# Altium project 左手键盘1.PrjPcb
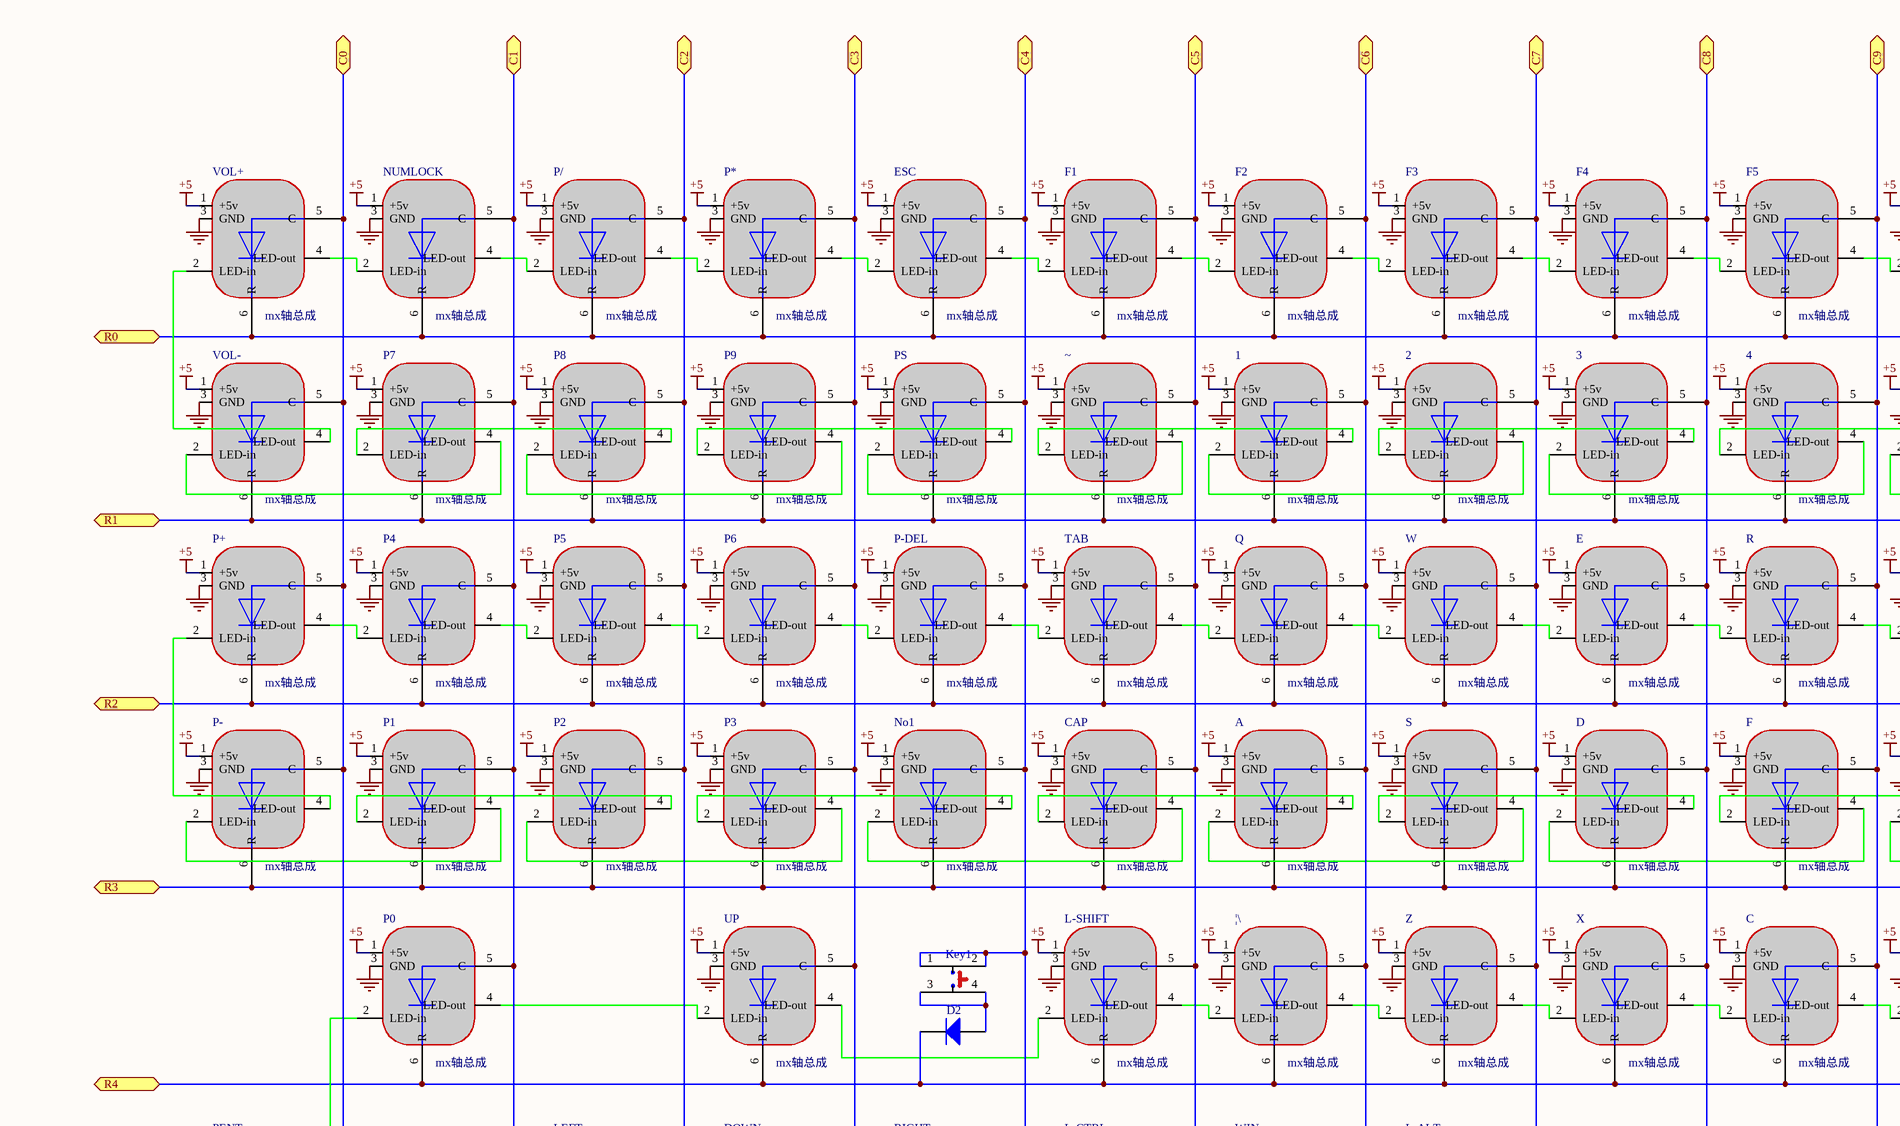
[diagram p0: 左手键盘1.SchDoc, top left]
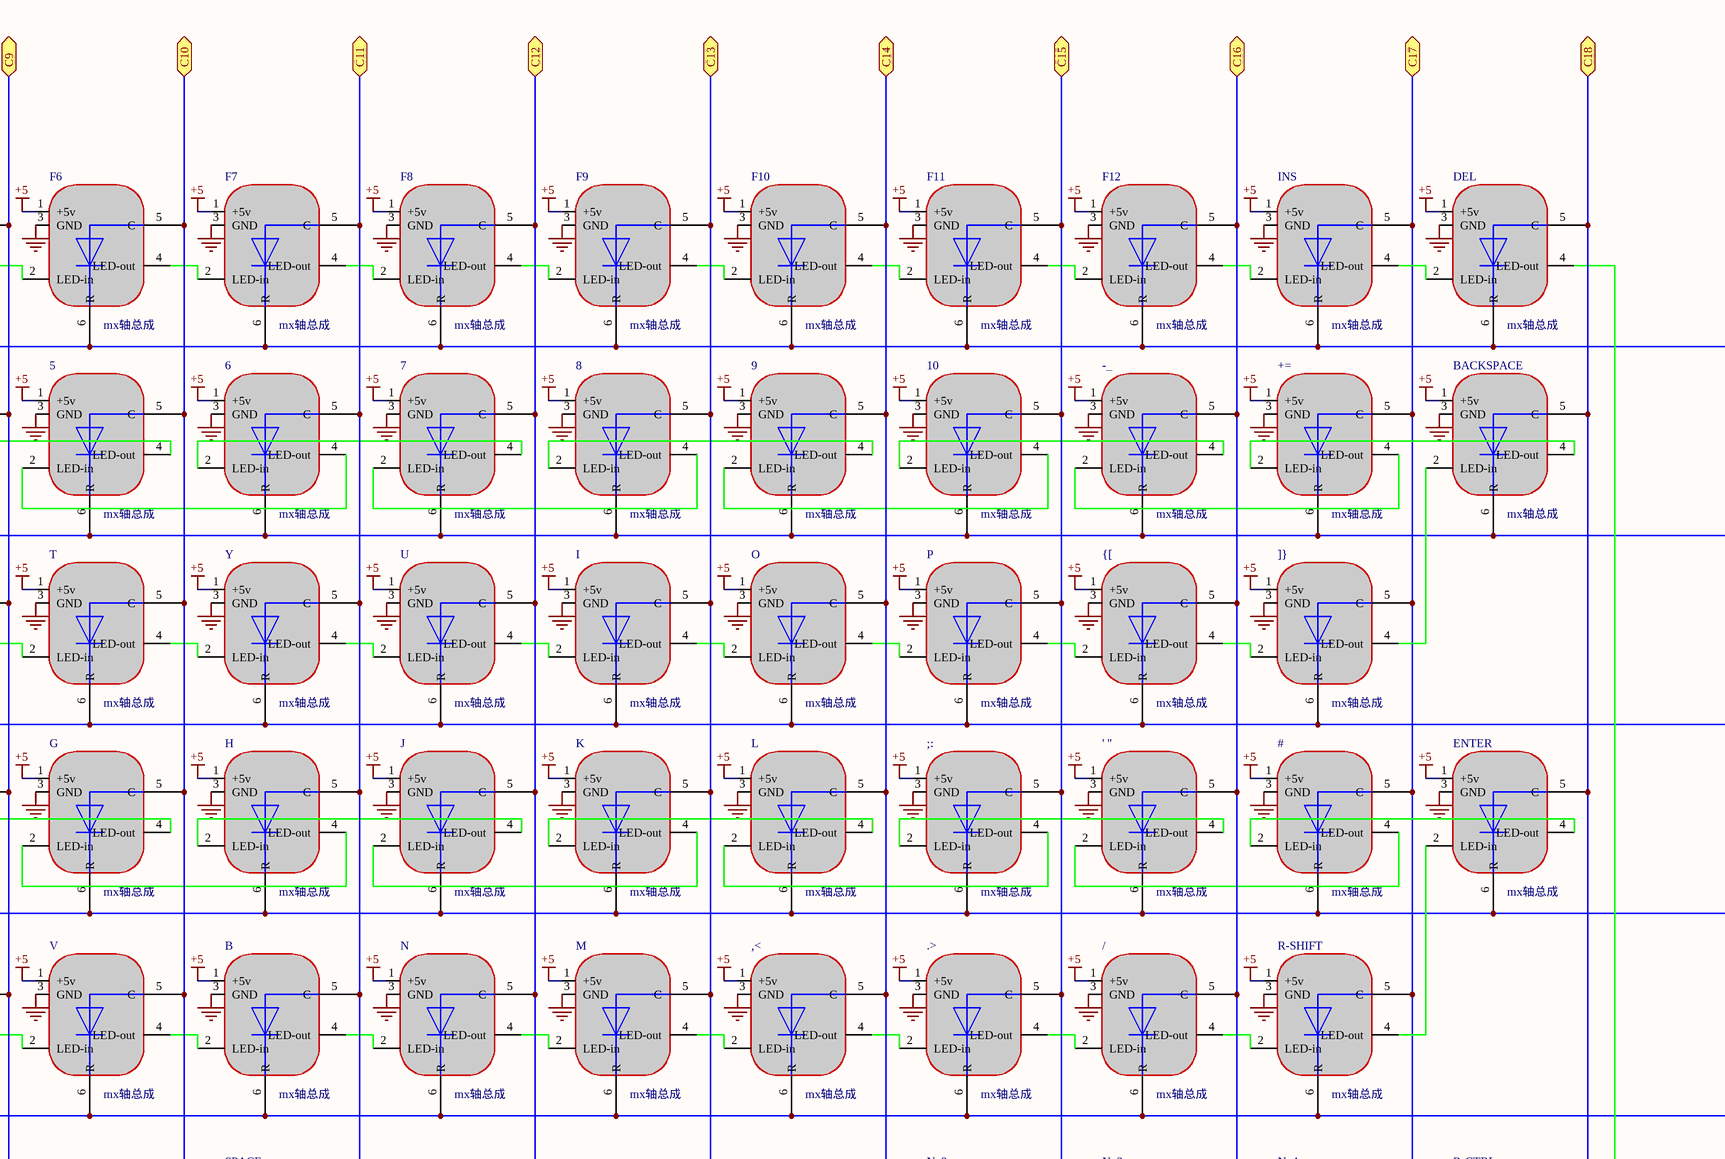
[diagram p1: 左手键盘1.SchDoc, top right]
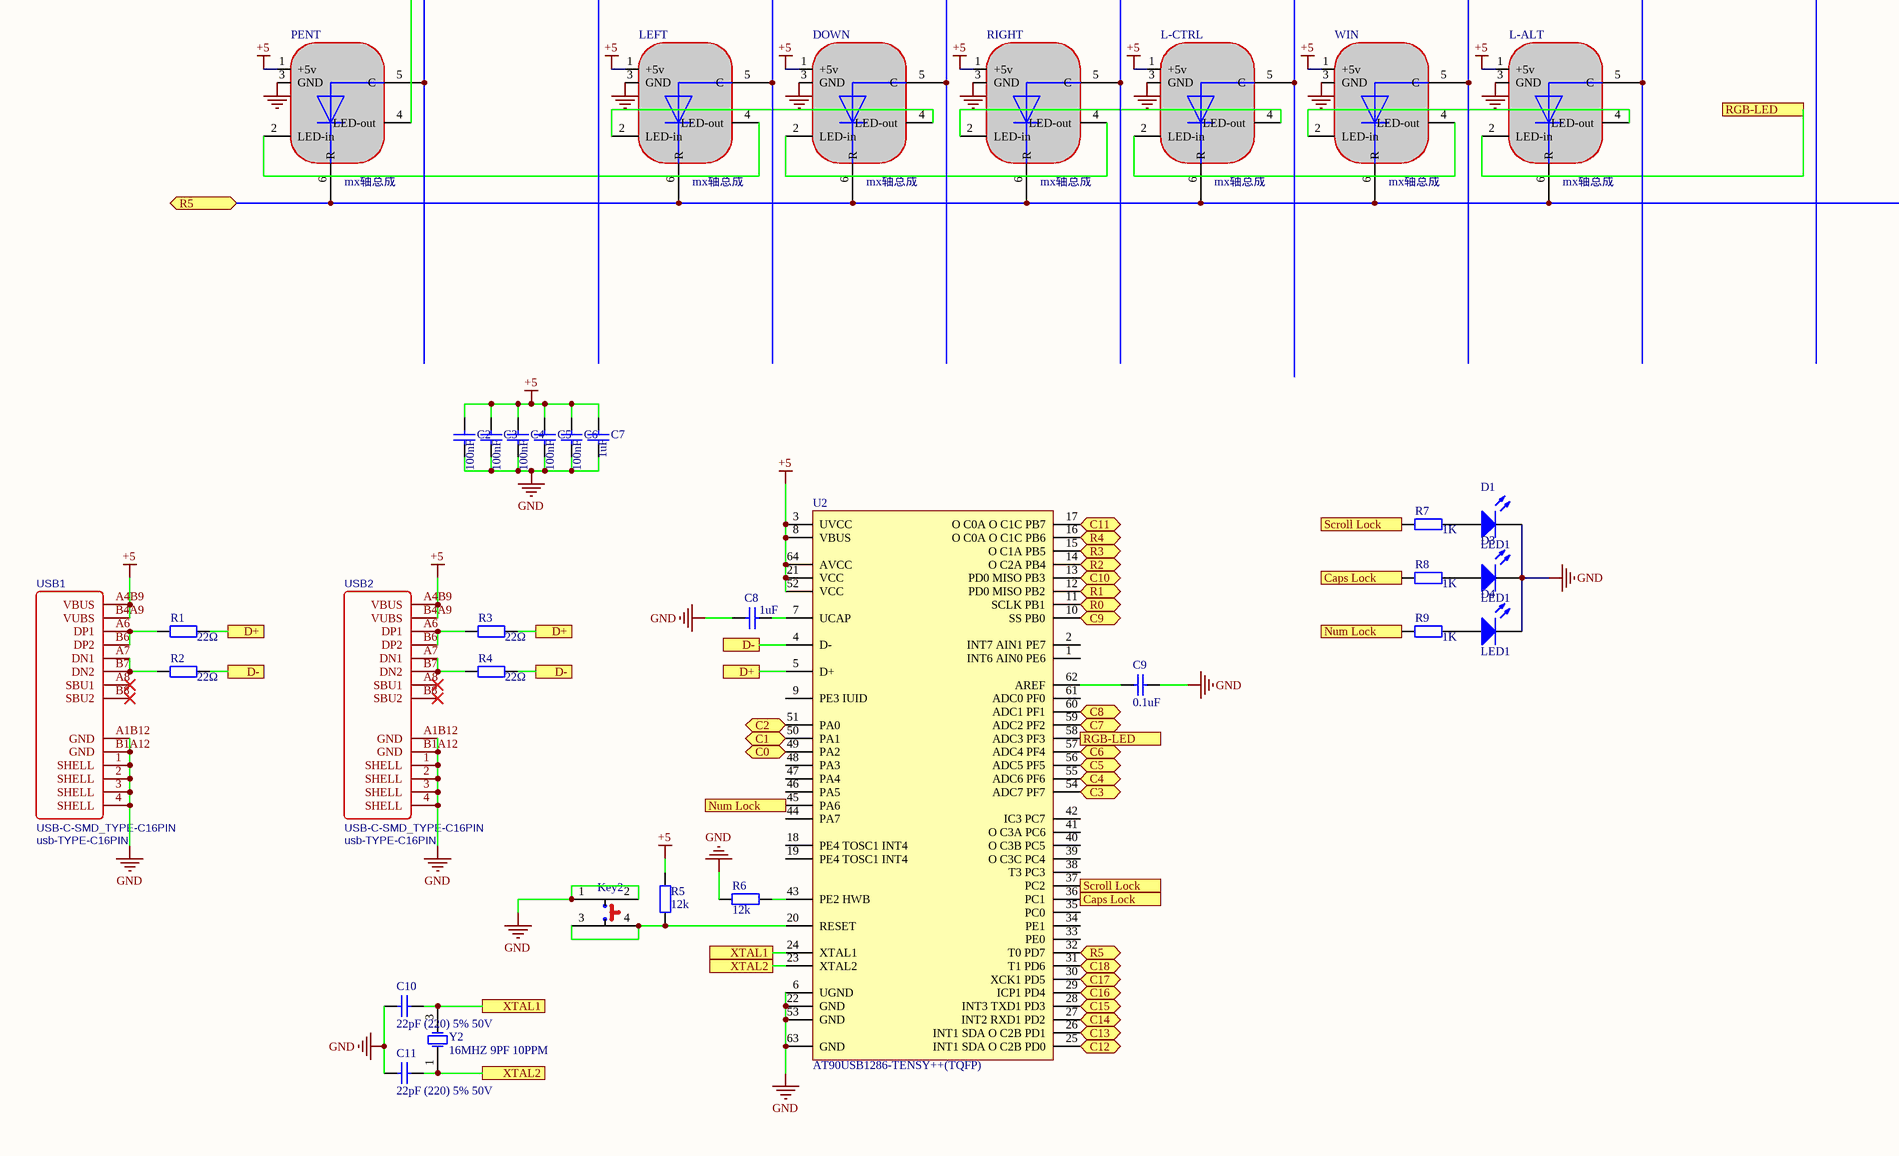
[diagram p2: 左手键盘1.SchDoc, bottom left]
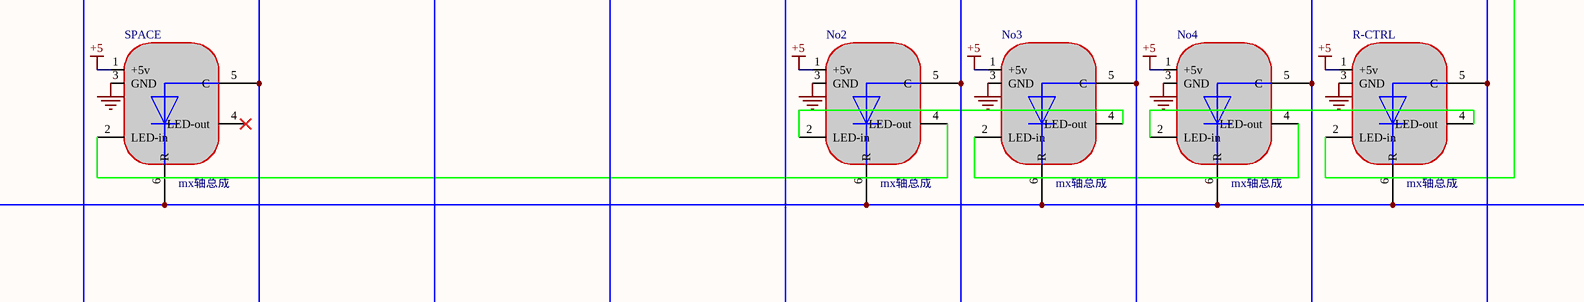
[diagram p3: 左手键盘1.SchDoc, bottom right]
1 sheet, 131 parts. Net scope: flat (ports and power ports of the same name join across sheets).
Board file: 左手键盘1.PcbDoc

## Sheet 左手键盘1.SchDoc
size A1

### Parts
1  mx轴总成  [mx-zc-fan]
2  mx轴总成  [mx-zc-fan]
3  mx轴总成  [mx-zc-fan]
4  mx轴总成  [mx-zc-fan]
5  mx轴总成  [mx-zc-fan]
6  mx轴总成  [mx-zc-fan]
7  mx轴总成  [mx-zc-fan]
8  mx轴总成  [mx-zc-fan]
9  mx轴总成  [mx-zc-fan]
10  mx轴总成  [mx-zc-fan]
#  mx轴总成  [mx-zc-fan]
'_"  mx轴总成  [mx-zc-fan]
+=  mx轴总成  [mx-zc-fan]
,<  mx轴总成  [mx-zc-zheng]
-_  mx轴总成  [mx-zc-fan]
.>  mx轴总成  [mx-zc-zheng]
/  mx轴总成  [mx-zc-zheng]
;:  mx轴总成  [mx-zc-fan]
]}  mx轴总成  [mx-zc-zheng]
A  mx轴总成  [mx-zc-fan]
B  mx轴总成  [mx-zc-zheng]
BACKSPACE  mx轴总成  [mx-zc-fan]
C  mx轴总成  [mx-zc-zheng]
C2  100nF  [C0805]
C3  100nF  [C0805]
C4  100nF  [C0805]
C5  100nF  [C0805]
C6  100nF  [C0805]
C7  1uF  [C0805]
C8  1uF  [C0805]
C9  0.1uF  [C0805]
C10  22pF (220) 5% 50V  [C0805]
C11  22pF (220) 5% 50V  [C0805]
CAP  mx轴总成  [mx-zc-fan]
D  mx轴总成  [mx-zc-fan]
D1  LED1  [LED0805背开孔]
D2  LL4148 LL-34 1206  [4148]  (value not drawn)
D3  LED1  [LED0805背开孔]
D4  LED1  [LED0805背开孔]
DEL  mx轴总成  [mx-zc-zheng]
DOWN  mx轴总成  [mx-zc-fan]
E  mx轴总成  [mx-zc-zheng]
ENTER  mx轴总成  [mx-zc-fan]
ESC  mx轴总成  [mx-zc-zheng]
F  mx轴总成  [mx-zc-fan]
F1  mx轴总成  [mx-zc-zheng]
F2  mx轴总成  [mx-zc-zheng]
F3  mx轴总成  [mx-zc-zheng]
F4  mx轴总成  [mx-zc-zheng]
F5  mx轴总成  [mx-zc-zheng]
F6  mx轴总成  [mx-zc-zheng]
F7  mx轴总成  [mx-zc-zheng]
F8  mx轴总成  [mx-zc-zheng]
F9  mx轴总成  [mx-zc-zheng]
F10  mx轴总成  [mx-zc-zheng]
F11  mx轴总成  [mx-zc-zheng]
F12  mx轴总成  [mx-zc-zheng]
G  mx轴总成  [mx-zc-fan]
H  mx轴总成  [mx-zc-fan]
I  mx轴总成  [mx-zc-zheng]
INS  mx轴总成  [mx-zc-zheng]
J  mx轴总成  [mx-zc-fan]
K  mx轴总成  [mx-zc-fan]
Key1  KEY-SMD_4P-L4.2-W3.2-P2.20-LS4.6  [key-4p-5*5mm]  (value not drawn)
Key2  KEY-SMD_4P-L4.2-W3.2-P2.20-LS4.6  [key-4p-5*5mm]  (value not drawn)
L  mx轴总成  [mx-zc-fan]
L-ALT  mx轴总成  [mx-zc-fan]
L-CTRL  mx轴总成  [mx-zc-fan]
L-SHIFT  mx轴总成  [MX-ZC-ZHENG]
LEFT  mx轴总成  [MX-ZC-FAN]
M  mx轴总成  [mx-zc-zheng]
N  mx轴总成  [mx-zc-zheng]
No1  mx轴总成  [mx-zc-fan]
No2  mx轴总成  [mx-zc-fan]
No3  mx轴总成  [mx-zc-fan]
No4  mx轴总成  [mx-zc-fan]
NUMLOCK  mx轴总成  [mx-zc-zheng]
O  mx轴总成  [mx-zc-zheng]
P  mx轴总成  [mx-zc-zheng]
P0  mx轴总成  [mx-zc-zheng]
P1  mx轴总成  [mx-zc-fan]
P2  mx轴总成  [mx-zc-fan]
P3  mx轴总成  [mx-zc-fan]
P4  mx轴总成  [mx-zc-zheng]
P5  mx轴总成  [mx-zc-zheng]
P6  mx轴总成  [mx-zc-zheng]
P7  mx轴总成  [mx-zc-fan]
P8  mx轴总成  [mx-zc-fan]
P9  mx轴总成  [mx-zc-fan]
P*  mx轴总成  [mx-zc-zheng]
P+  mx轴总成  [mx-zc-zheng]
P-  mx轴总成  [mx-zc-fan]
P-DEL  mx轴总成  [mx-zc-zheng]
P/  mx轴总成  [mx-zc-zheng]
PENT  mx轴总成  [mx-zc-fan]
PS  mx轴总成  [mx-zc-fan]
Q  mx轴总成  [mx-zc-zheng]
R  mx轴总成  [mx-zc-zheng]
R1  22Ω  [R0805]
R2  22Ω  [R0805]
R3  22Ω  [R0805]
R4  22Ω  [R0805]
R5  12k  [R0805]
R6  12k  [R0805]
R7  1K  [R0805]
R8  1K  [R0805]
R9  1K  [R0805]
R-CTRL  mx轴总成  [mx-zc-fan]
R-SHIFT  mx轴总成  [mx-zc-zheng]
RIGHT  mx轴总成  [mx-zc-fan]
S  mx轴总成  [mx-zc-fan]
SPACE  mx轴总成  [mx-zc-fan]
T  mx轴总成  [mx-zc-zheng]
TAB  mx轴总成  [mx-zc-zheng]
U  mx轴总成  [mx-zc-zheng]
U2  AT90USB1286-TENSY++(TQFP)  [QFN64 9x9_M]
UP  mx轴总成  [mx-zc-zheng]
USB1  usb-TYPE-C16PIN  [USB-C-SMD_TYPE-C16PIN]
USB2  usb-TYPE-C16PIN  [USB-C-SMD_TYPE-C16PIN]
V  mx轴总成  [mx-zc-zheng]
VOL+  mx轴总成  [mx-zc-zheng]
VOL-  mx轴总成  [mx-zc-fan]
W  mx轴总成  [mx-zc-zheng]
WIN  mx轴总成  [mx-zc-fan]
X  mx轴总成  [mx-zc-zheng]
Y  mx轴总成  [mx-zc-zheng]
Y2  16MHZ 9PF 10PPM  [SMD-3225_4P]
Z  mx轴总成  [mx-zc-zheng]
{[  mx轴总成  [mx-zc-zheng]
~  mx轴总成  [mx-zc-fan]
|\  mx轴总成  [mx-zc-zheng]

### Ports
C0 (bidir), C1 (bidir), C2 (bidir), C3 (bidir), C4 (bidir), C5 (bidir), C6 (bidir), C7 (bidir), C8 (bidir), C9 (bidir), C10 (bidir), C11 (bidir), C12 (bidir), C13 (bidir), C14 (bidir), C15 (bidir), C16 (bidir), C17 (bidir), C18 (bidir), Caps Lock, D+, D-, Num Lock, R0 (bidir), R1 (bidir), R2 (bidir), R3 (bidir), R4 (bidir), R5 (bidir), RGB-LED, RGB-LED (out), Scroll Lock, XTAL1, XTAL2

### Nets
+5: 1.1(+5v) 2.1(+5v) 3.1(+5v) 4.1(+5v) 5.1(+5v) 6.1(+5v) 7.1(+5v) 8.1(+5v) 9.1(+5v) 10.1(+5v) #.1(+5v) '_".1(+5v) +=.1(+5v) ,<.1(+5v) -_.1(+5v) .>.1(+5v) /.1(+5v) ;:.1(+5v) ]}.1(+5v) A.1(+5v) B.1(+5v) BACKSPACE.1(+5v) C.1(+5v) C2.2 C3.2 C4.2 C5.2 C6.2 C7.2 CAP.1(+5v) D.1(+5v) DEL.1(+5v) DOWN.1(+5v) E.1(+5v) ENTER.1(+5v) ESC.1(+5v) F.1(+5v) F1.1(+5v) F2.1(+5v) F3.1(+5v) F4.1(+5v) F5.1(+5v) F6.1(+5v) F7.1(+5v) F8.1(+5v) F9.1(+5v) F10.1(+5v) F11.1(+5v) F12.1(+5v) G.1(+5v) H.1(+5v) I.1(+5v) INS.1(+5v) J.1(+5v) K.1(+5v) L.1(+5v) L-ALT.1(+5v) L-CTRL.1(+5v) L-SHIFT.1(+5v) LEFT.1(+5v) M.1(+5v) N.1(+5v) No1.1(+5v) No2.1(+5v) No3.1(+5v) No4.1(+5v) NUMLOCK.1(+5v) O.1(+5v) P.1(+5v) P0.1(+5v) P1.1(+5v) P2.1(+5v) P3.1(+5v) P4.1(+5v) P5.1(+5v) P6.1(+5v) P7.1(+5v) P8.1(+5v) P9.1(+5v) P*.1(+5v) P+.1(+5v) P-.1(+5v) P-DEL.1(+5v) P/.1(+5v) PENT.1(+5v) PS.1(+5v) Q.1(+5v) R.1(+5v) R5.2 R-CTRL.1(+5v) R-SHIFT.1(+5v) RIGHT.1(+5v) S.1(+5v) SPACE.1(+5v) T.1(+5v) TAB.1(+5v) U.1(+5v) U2.3(UVCC) U2.8(VBUS) U2.21(VCC) U2.52(VCC) U2.64(AVCC) UP.1(+5v) USB1.A4B9(VBUS) USB1.B4A9(VUBS) USB2.A4B9(VBUS) USB2.B4A9(VUBS) V.1(+5v) VOL+.1(+5v) VOL-.1(+5v) W.1(+5v) WIN.1(+5v) X.1(+5v) Y.1(+5v) Z.1(+5v) {[.1(+5v) ~.1(+5v) |\.1(+5v)
GND: 1.3(GND) 2.3(GND) 3.3(GND) 4.3(GND) 5.3(GND) 6.3(GND) 7.3(GND) 8.3(GND) 9.3(GND) 10.3(GND) #.3(GND) '_".3(GND) +=.3(GND) ,<.3(GND) -_.3(GND) .>.3(GND) /.3(GND) ;:.3(GND) ]}.3(GND) A.3(GND) B.3(GND) BACKSPACE.3(GND) C.3(GND) C2.1 C3.1 C4.1 C5.1 C6.1 C7.1 C8.1 C9.2 C10.1 C11.1 CAP.3(GND) D.3(GND) D1.2(K) D3.2(K) D4.2(K) DEL.3(GND) DOWN.3(GND) E.3(GND) ENTER.3(GND) ESC.3(GND) F.3(GND) F1.3(GND) F2.3(GND) F3.3(GND) F4.3(GND) F5.3(GND) F6.3(GND) F7.3(GND) F8.3(GND) F9.3(GND) F10.3(GND) F11.3(GND) F12.3(GND) G.3(GND) H.3(GND) I.3(GND) INS.3(GND) J.3(GND) K.3(GND) Key2.1 Key2.2 L.3(GND) L-ALT.3(GND) L-CTRL.3(GND) L-SHIFT.3(GND) LEFT.3(GND) M.3(GND) N.3(GND) No1.3(GND) No2.3(GND) No3.3(GND) No4.3(GND) NUMLOCK.3(GND) O.3(GND) P.3(GND) P0.3(GND) P1.3(GND) P2.3(GND) P3.3(GND) P4.3(GND) P5.3(GND) P6.3(GND) P7.3(GND) P8.3(GND) P9.3(GND) P*.3(GND) P+.3(GND) P-.3(GND) P-DEL.3(GND) P/.3(GND) PENT.3(GND) PS.3(GND) Q.3(GND) R.3(GND) R6.2 R-CTRL.3(GND) R-SHIFT.3(GND) RIGHT.3(GND) S.3(GND) SPACE.3(GND) T.3(GND) TAB.3(GND) U.3(GND) U2.6(UGND) U2.22(GND) U2.53(GND) U2.63(GND) UP.3(GND) USB1.1(SHELL) USB1.2(SHELL) USB1.3(SHELL) USB1.4(SHELL) USB1.A1B12(GND) USB1.B1A12(GND) USB2.1(SHELL) USB2.2(SHELL) USB2.3(SHELL) USB2.4(SHELL) USB2.A1B12(GND) USB2.B1A12(GND) V.3(GND) VOL+.3(GND) VOL-.3(GND) W.3(GND) WIN.3(GND) X.3(GND) Y.3(GND) Z.3(GND) {[.3(GND) ~.3(GND) |\.3(GND)
Net1_2: 1.2(LED-in) 2.4(LED-out)
Net1_4: 1.4(LED-out) ~.2(LED-in)
Net1_5: 1.5(C) A.5(C) F2.5(C) Q.5(C) U2.57(ADC4_PF4) WIN.5(C) |\.5(C) ; port C6
Net1_6: 1.6(R) 2.6(R) 3.6(R) 4.6(R) 5.6(R) 6.6(R) 7.6(R) 8.6(R) 9.6(R) 10.6(R) +=.6(R) -_.6(R) BACKSPACE.6(R) P7.6(R) P8.6(R) P9.6(R) PS.6(R) U2.12(PD0_MISO_PB2) VOL-.6(R) ~.6(R) ; port R1
Net2_2: 2.2(LED-in) 3.4(LED-out)
Net2_5: 2.5(C) F3.5(C) L-ALT.5(C) S.5(C) U2.59(ADC2_PF2) W.5(C) Z.5(C) ; port C7
Net3_2: 3.2(LED-in) 4.4(LED-out)
Net3_5: 3.5(C) D.5(C) E.5(C) F4.5(C) U2.60(ADC1_PF1) X.5(C) ; port C8
Net4_2: 4.2(LED-in) 5.4(LED-out)
Net4_5: 4.5(C) C.5(C) F.5(C) F5.5(C) R.5(C) U2.10(SS_PB0) ; port C9
Net5_2: 5.2(LED-in) 6.4(LED-out)
Net5_5: 5.5(C) F6.5(C) G.5(C) T.5(C) U2.13(PD0_MISO_PB3) V.5(C) ; port C10
Net6_2: 6.2(LED-in) 7.4(LED-out)
Net6_5: 6.5(C) B.5(C) F7.5(C) H.5(C) SPACE.5(C) U2.17(O_C0A_O_C1C_PB7) Y.5(C) ; port C11
Net7_2: 7.2(LED-in) 8.4(LED-out)
Net7_5: 7.5(C) F8.5(C) J.5(C) N.5(C) U.5(C) U2.25(INT1_SDA_O_C2B_PD0) ; port C12
Net8_2: 8.2(LED-in) 9.4(LED-out)
Net8_5: 8.5(C) F9.5(C) I.5(C) K.5(C) M.5(C) U2.26(INT1_SDA_O_C2B_PD1) ; port C13
Net9_2: 9.2(LED-in) 10.4(LED-out)
Net9_5: 9.5(C) ,<.5(C) F10.5(C) L.5(C) O.5(C) U2.27(INT2_RXD1_PD2) ; port C14
Net10_2: 10.2(LED-in) -_.4(LED-out)
Net10_5: 10.5(C) .>.5(C) ;:.5(C) F11.5(C) No2.5(C) P.5(C) U2.28(INT3_TXD1_PD3) ; port C15
Net#_2: #.2(LED-in) ENTER.4(LED-out)
Net#_4: #.4(LED-out) '_".2(LED-in)
Net#_5: #.5(C) +=.5(C) ]}.5(C) INS.5(C) No4.5(C) R-SHIFT.5(C) U2.30(XCK1_PD5) ; port C17
Net#_6: #.6(R) '_".6(R) ;:.6(R) A.6(R) CAP.6(R) D.6(R) ENTER.6(R) F.6(R) G.6(R) H.6(R) J.6(R) K.6(R) L.6(R) No1.6(R) P1.6(R) P2.6(R) P3.6(R) P-.6(R) S.6(R) U2.15(O_C1A_PB5) ; port R3
Net'_"_4: '_".4(LED-out) ;:.2(LED-in)
Net'_"_5: '_".5(C) -_.5(C) /.5(C) F12.5(C) No3.5(C) U2.29(ICP1_PD4) {[.5(C) ; port C16
Net+=_2: +=.2(LED-in) BACKSPACE.4(LED-out)
Net+=_4: +=.4(LED-out) -_.2(LED-in)
Net,<_2: ,<.2(LED-in) M.4(LED-out)
Net,<_4: ,<.4(LED-out) .>.2(LED-in)
Net,<_6: ,<.6(R) .>.6(R) /.6(R) B.6(R) C.6(R) D2.2(K) L-SHIFT.6(R) M.6(R) N.6(R) P0.6(R) R-SHIFT.6(R) U2.16(O_C0A_O_C1C_PB6) UP.6(R) V.6(R) X.6(R) Z.6(R) |\.6(R) ; port R4
Net.>_4: .>.4(LED-out) /.2(LED-in)
Net/_4: /.4(LED-out) R-SHIFT.2(LED-in)
Net;:_4: ;:.4(LED-out) L.2(LED-in)
Net]}_2: ]}.2(LED-in) {[.4(LED-out)
Net]}_4: ]}.4(LED-out) BACKSPACE.2(LED-in)
Net]}_6: ]}.6(R) E.6(R) I.6(R) O.6(R) P.6(R) P4.6(R) P5.6(R) P6.6(R) P+.6(R) P-DEL.6(R) Q.6(R) R.6(R) T.6(R) TAB.6(R) U.6(R) U2.14(O_C2A_PB4) W.6(R) Y.6(R) {[.6(R) ; port R2
NetA_2: A.2(LED-in) S.4(LED-out)
NetA_4: A.4(LED-out) CAP.2(LED-in)
NetB_2: B.2(LED-in) V.4(LED-out)
NetB_4: B.4(LED-out) N.2(LED-in)
NetBACKSPACE_5: BACKSPACE.5(C) DEL.5(C) ENTER.5(C) R-CTRL.5(C) U2.31(T1_PD6) ; port C18
NetC8_2: C8.2 U2.7(UCAP)
NetC9_1: C9.1 U2.62(AREF)
NetC10_2: C10.2 U2.24(XTAL1) Y2.3(OSC2) ; port XTAL1
NetC11_2: C11.2 U2.23(XTAL2) Y2.1(OSC1) ; port XTAL2
NetC_2: C.2(LED-in) X.4(LED-out)
NetC_4: C.4(LED-out) V.2(LED-in)
NetCAP_4: CAP.4(LED-out) No1.2(LED-in)
NetCAP_5: CAP.5(C) F1.5(C) L-CTRL.5(C) L-SHIFT.5(C) TAB.5(C) U2.56(ADC5_PF5) ~.5(C) ; port C5
NetD1_1: D1.1(A) R7.2
NetD2_1: D2.1(A) Key1.3 Key1.4
NetD3_1: D3.1(A) R8.2
NetD4_1: D4.1(A) R9.2
NetD_2: D.2(LED-in) F.4(LED-out)
NetD_4: D.4(LED-out) S.2(LED-in)
NetDEL_2: DEL.2(LED-in) INS.4(LED-out)
NetDEL_4: DEL.4(LED-out) R-CTRL.2(LED-in)
NetDEL_6: DEL.6(R) ESC.6(R) F1.6(R) F2.6(R) F3.6(R) F4.6(R) F5.6(R) F6.6(R) F7.6(R) F8.6(R) F9.6(R) F10.6(R) F11.6(R) F12.6(R) INS.6(R) NUMLOCK.6(R) P*.6(R) P/.6(R) U2.11(SCLK_PB1) VOL+.6(R) ; port R0
NetDOWN_2: DOWN.2(LED-in) RIGHT.4(LED-out)
NetDOWN_4: DOWN.4(LED-out) LEFT.2(LED-in)
NetDOWN_5: DOWN.5(C) P3.5(C) P6.5(C) P9.5(C) P*.5(C) U2.54(ADC7_PF7) UP.5(C) ; port C3
NetDOWN_6: DOWN.6(R) L-ALT.6(R) L-CTRL.6(R) LEFT.6(R) No2.6(R) No3.6(R) No4.6(R) PENT.6(R) R-CTRL.6(R) RIGHT.6(R) SPACE.6(R) U2.32(T0_PD7) WIN.6(R) ; port R5
NetE_2: E.2(LED-in) W.4(LED-out)
NetE_4: E.4(LED-out) R.2(LED-in)
NetENTER_2: ENTER.2(LED-in) R-SHIFT.4(LED-out)
NetESC_2: ESC.2(LED-in) P*.4(LED-out)
NetESC_4: ESC.4(LED-out) F1.2(LED-in)
NetESC_5: ESC.5(C) Key1.1 Key1.2 No1.5(C) P-DEL.5(C) PS.5(C) RIGHT.5(C) U2.55(ADC6_PF6) ; port C4
NetF1_4: F1.4(LED-out) F2.2(LED-in)
NetF2_4: F2.4(LED-out) F3.2(LED-in)
NetF3_4: F3.4(LED-out) F4.2(LED-in)
NetF4_4: F4.4(LED-out) F5.2(LED-in)
NetF5_4: F5.4(LED-out) F6.2(LED-in)
NetF6_4: F6.4(LED-out) F7.2(LED-in)
NetF7_4: F7.4(LED-out) F8.2(LED-in)
NetF8_4: F8.4(LED-out) F9.2(LED-in)
NetF9_4: F9.4(LED-out) F10.2(LED-in)
NetF10_4: F10.4(LED-out) F11.2(LED-in)
NetF11_4: F11.4(LED-out) F12.2(LED-in)
NetF12_4: F12.4(LED-out) INS.2(LED-in)
NetF_2: F.2(LED-in) G.4(LED-out)
NetG_2: G.2(LED-in) H.4(LED-out)
NetH_2: H.2(LED-in) J.4(LED-out)
NetI_2: I.2(LED-in) U.4(LED-out)
NetI_4: I.4(LED-out) O.2(LED-in)
NetJ_2: J.2(LED-in) K.4(LED-out)
NetK_2: K.2(LED-in) L.4(LED-out)
NetKey2_3: Key2.3 Key2.4 R5.1 U2.20(RESET)
NetL-ALT_2: L-ALT.2(LED-in) U2.58(ADC3_PF3) ; port RGB-LED
NetL-ALT_4: L-ALT.4(LED-out) WIN.2(LED-in)
NetL-CTRL_2: L-CTRL.2(LED-in) WIN.4(LED-out)
NetL-CTRL_4: L-CTRL.4(LED-out) RIGHT.2(LED-in)
NetL-SHIFT_2: L-SHIFT.2(LED-in) UP.4(LED-out)
NetL-SHIFT_4: L-SHIFT.4(LED-out) |\.2(LED-in)
NetLEFT_4: LEFT.4(LED-out) PENT.2(LED-in)
NetLEFT_5: LEFT.5(C) P2.5(C) P5.5(C) P8.5(C) P/.5(C) U2.51(PA0) ; port C2
NetM_2: M.2(LED-in) N.4(LED-out)
NetNo1_4: No1.4(LED-out) P3.2(LED-in)
NetNo2_2: No2.2(LED-in) No3.4(LED-out)
NetNo2_4: No2.4(LED-out) SPACE.2(LED-in)
NetNo3_2: No3.2(LED-in) No4.4(LED-out)
NetNo4_2: No4.2(LED-in) R-CTRL.4(LED-out)
NetNUMLOCK_2: NUMLOCK.2(LED-in) VOL+.4(LED-out)
NetNUMLOCK_4: NUMLOCK.4(LED-out) P/.2(LED-in)
NetNUMLOCK_5: NUMLOCK.5(C) P0.5(C) P1.5(C) P4.5(C) P7.5(C) U2.50(PA1) ; port C1
NetO_4: O.4(LED-out) P.2(LED-in)
NetP0_2: P0.2(LED-in) PENT.4(LED-out)
NetP0_4: P0.4(LED-out) UP.2(LED-in)
NetP1_2: P1.2(LED-in) P2.4(LED-out)
NetP1_4: P1.4(LED-out) P-.2(LED-in)
NetP2_2: P2.2(LED-in) P3.4(LED-out)
NetP4_2: P4.2(LED-in) P+.4(LED-out)
NetP4_4: P4.4(LED-out) P5.2(LED-in)
NetP5_4: P5.4(LED-out) P6.2(LED-in)
NetP6_4: P6.4(LED-out) P-DEL.2(LED-in)
NetP7_2: P7.2(LED-in) P8.4(LED-out)
NetP7_4: P7.4(LED-out) VOL-.2(LED-in)
NetP8_2: P8.2(LED-in) P9.4(LED-out)
NetP9_2: P9.2(LED-in) PS.4(LED-out)
NetP*_2: P*.2(LED-in) P/.4(LED-out)
NetP+_2: P+.2(LED-in) P-.4(LED-out)
NetP+_5: P+.5(C) P-.5(C) PENT.5(C) U2.49(PA2) VOL+.5(C) VOL-.5(C) ; port C0
NetP-DEL_4: P-DEL.4(LED-out) TAB.2(LED-in)
NetP_4: P.4(LED-out) {[.2(LED-in)
NetPS_2: PS.2(LED-in) ~.4(LED-out)
NetQ_2: Q.2(LED-in) TAB.4(LED-out)
NetQ_4: Q.4(LED-out) W.2(LED-in)
NetR1_1: R1.1 USB1.A6(DP1) USB1.B6(DP2)
NetR1_2: R1.2 R3.2 U2.5(D+) ; port D+
NetR2_1: R2.1 USB1.A7(DN1) USB1.B7(DN2)
NetR2_2: R2.2 R4.2 U2.4(D-) ; port D-
NetR3_1: R3.1 USB2.A6(DP1) USB2.B6(DP2)
NetR4_1: R4.1 USB2.A7(DN1) USB2.B7(DN2)
NetR6_1: R6.1 U2.43(PE2_HWB)
NetR7_1: R7.1 U2.37(PC2) ; port Scroll Lock
NetR8_1: R8.1 U2.36(PC1) ; port Caps Lock
NetR9_1: R9.1 U2.45(PA6) ; port Num Lock
NetR_4: R.4(LED-out) T.2(LED-in)
NetT_4: T.4(LED-out) Y.2(LED-in)
NetU_2: U.2(LED-in) Y.4(LED-out)
NetVOL+_2: VOL+.2(LED-in) VOL-.4(LED-out)
NetX_2: X.2(LED-in) Z.4(LED-out)
NetZ_2: Z.2(LED-in) |\.4(LED-out)

Not connected (* = marked no-connect by the designer): SPACE 4(LED-out)*; U2 1(INT6_AIN0_PE6) 2(INT7_AIN1_PE7) 9(PE3_IUID) 18(PE4_TOSC1_INT4) 19(PE4_TOSC1_INT4) 33(PE0) 34(PE1) 35(PC0) 38(T3_PC3) 39(O_C3C_PC4) 40(O_C3B_PC5) 41(O_C3A_PC6) 42(IC3_PC7) 44(PA7) 46(PA5) 47(PA4) 48(PA3) 61(ADC0_PF0); USB1 A8(SBU1)* B8(SBU2)*; USB2 A8(SBU1)* B8(SBU2)*

### Notes on the sheet
- (in symbol usb-TYPE-C16PIN) USB-C-SMD_TYPE-C16PIN

### Library data of the parts
1-10 # '_" += ,< -_ .> / ;: ]} A B BACKSPACE C CAP D DEL DOWN E ENTER ESC F F1-F12 G H I INS J K L L-ALT L-CTRL L-SHIFT LEFT M N No1-No4 NUMLOCK O P P0-P9 P* P+ P- P-DEL P/ PENT PS Q R R-CTRL R-SHIFT RIGHT S SPACE T TAB U UP V VOL+ VOL- W WIN X Y Z {[ ~ |\ = mx轴总成: KEY
C2-C7 = 0805 100nF(104) 10% 50V: 贴片电容; ComponentLink1Description: 供应商链接; ComponentLink1URL: http://www.szlcsc.com/product/details_50686.html; Package: 0805; Supplier: LC; SuppliersPartNumber: C49678
C8 C9 = 0805 10uF (106) 10% 25V: 贴片电容; ComponentLink1Description: 供应商链接; ComponentLink1URL: http://www.szlcsc.com/product/details_16532.html; Package: 0805; Supplier: LC; SuppliersPartNumber: C15850
C10 C11 = 0805 22pF (220) 5% 50V: 贴片电容; ComponentLink1Description: 供应商链接; ComponentLink1URL: http://www.szlcsc.com/product/details_2156.html; Package: 0805; Supplier: LC; SuppliersPartNumber: C1804
D1 D3 D4 = LED1: Typical RED GaAs LED; Published: 8-Jun-2000; LatestRevisionDate: 08-Jul-2005; LatestRevisionNote: Mech Layer 1 removed.; PackageReference: LED-1; Publisher: Altium Limited; PackageDescription: LED; 2 Leads
D2 = LL-34 LL4148 LL-34 1206: 开关二极管; ComponentLink1Description: 供应商链接; ComponentLink1URL: http://www.szlcsc.com/product/details_10338.html; Package: LL-34; Supplier: LC; SuppliersPartNumber: C9808
R1-R4 R7-R9 = 0805 10Ω (10R0) 1%: 贴片电阻; ComponentLink1Description: 供应商链接; ComponentLink1URL: http://www.szlcsc.com/product/details_18103.html; Package: 0805; Supplier: LC; SuppliersPartNumber: C17415
R5 R6 = 0805 1.5MΩ (1504) 1%: 贴片电阻; ComponentLink1Description: 供应商链接; ComponentLink1URL: http://www.szlcsc.com/product/details_26853.html; Package: 0805; Supplier: LC; SuppliersPartNumber: C26110
USB1 USB2 = usb-TYPE-C16PIN: BOM_Manufacturer: SHOU HAN; Contributor: shiyindebcd; Package Display: Yes; BOM_Supplier: LCSC; BOM_Supplier Part: C393939; BOM_Manufacturer Part: TYPE-C16PIN; spicePre: U; spiceSymbolName: usb-TYPE-C16PIN
Y2 = SMD-3225_4P  16MHZ 9PF 10PPM: 贴片晶振; ComponentLink1Description: 供应商链接; ComponentLink1URL: http://www.szlcsc.com/product/details_14393.html; Package: SMD-3225_4P; Supplier: LC; SuppliersPartNumber: C13738